# EAGLE design LoRaPi-0 (EAGLE 9.6.2)
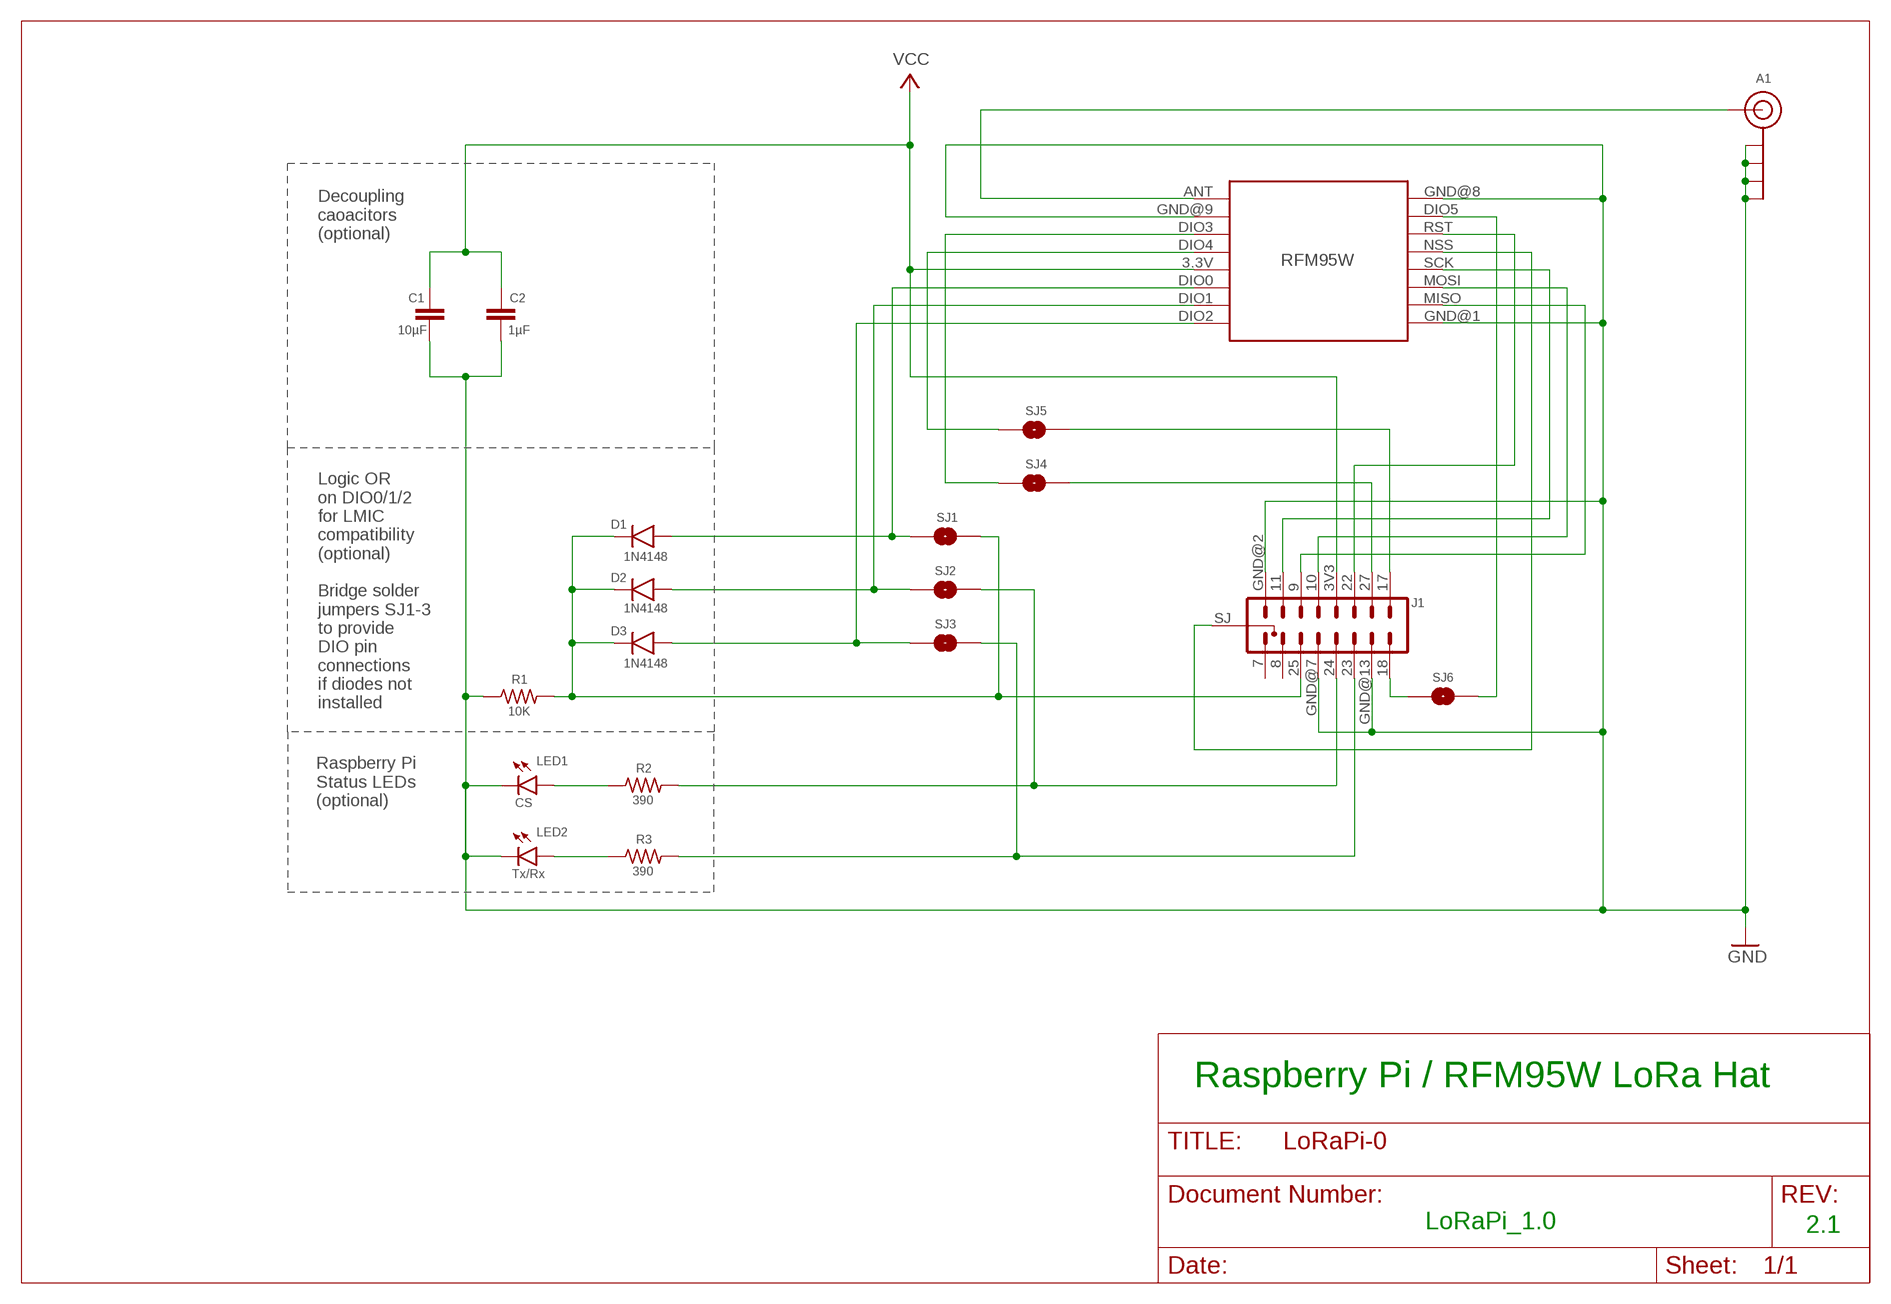
[diagram p0: schematic, sheet 1]

## Parts
A1  U.FL-SMA-EDGE-COMBO  [U.FL-SMA-EDGE-COMBO]
C1  10µF  CAPACITOR  [C0805]
C2  1µF  CAPACITOR  [C0805]
D1  1N4148  1N4148SMD  [SOD-123]
D2  1N4148  1N4148SMD  [SOD-123]
D3  1N4148  1N4148SMD  [SOD-123]
J1  HEADER-2X8-RFM95W-PI  [CONN_2X8-RFM-PI]
LED1  CS  LEDCHIP-LED0805  [CHIP-LED0805]
LED2  Tx/Rx  LEDCHIP-LED0805  [CHIP-LED0805]
R1  10K  R-US_R0805  [R0805]
R2  390  R-US_R0805  [R0805]
R3  390  R-US_R0805  [R0805]
RFM95W  RFM95W-LORA  [RFM95W-LORA]
SJ1  SJ  [SJ]
SJ2  SJ  [SJ]
SJ3  SJ  [SJ]
SJ4  SJ  [SJ]
SJ5  SJ  [SJ]
SJ6  SJ  [SJ]

## Nets
GND: A1.GND@1A(GND) A1.GND@1B(GND) A1.GND@2A(GND) A1.GND@2B(GND) C1.2 C2.2 J1.GND@2 J1.GND@7 J1.GND@13 LED1.C LED2.C R1.1 RFM95W.GND@1(GND.1) RFM95W.GND@8(GND.2) RFM95W.GND@9(GND.3)
N$1: LED2.A R3.1
N$2: LED1.A R2.1
N$3: J1.18 SJ6.1
N$4: J1.SJ(8-9) RFM95W.NSS
N$5: J1.23 R3.2 SJ3.2
N$6: J1.24 R2.2 SJ2.2
N$7: D1.2 RFM95W.DIO0 SJ1.1
N$8: RFM95W.DIO4 SJ5.1
N$9: RFM95W.DIO3 SJ4.1
N$10: D1.1 D2.1 D3.1 J1.25 R1.2 SJ1.2
N$11: A1.SIG RFM95W.ANT
N$12: D2.2 RFM95W.DIO1 SJ2.1
N$13: J1.22 RFM95W.RST
N$14: D3.2 RFM95W.DIO2 SJ3.1
N$15: J1.11 RFM95W.SCK
N$16: J1.10 RFM95W.MOSI
N$17: J1.9 RFM95W.MISO
N$18: J1.27 SJ4.2
N$19: J1.17 SJ5.2
N$20: RFM95W.DIO5 SJ6.2
VCC: C1.1 C2.1 J1.3V3 RFM95W.3.3V
Unconnected: J1.7 J1.8

## Notes on the sheet
- Decoupling
  caoacitors
  (optional)
- Logic OR
  on DIO0/1/2
  for LMIC
  compatibility
  (optional)
  
  Bridge solder
  jumpers SJ1-3
  to provide
  DIO pin
  connections
  if diodes not
  installed
- Raspberry Pi
  Status LEDs
  (optional)
- Raspberry Pi / RFM95W LoRa Hat
- LoRaPi_1.0 | 2.1

## Library data of the parts
A1 = digitalconcepts:U.FL-SMA-EDGE-COMBO: Combination u.FL & SMA edge mount antenna
C1 C2 = digitalconcepts:CAPACITOR: 0805 Capacitor
D1-D3 = digitalconcepts:1N4148: 1N4148 SOD-123 Signal Diode
J1 = digitalconcepts:HEADER-2X8-RFM95W-PI: PI-RFM95W 2x16 Pin Header for Raspberry Pi RFM95W daughter baord
LED1 LED2 = led:LED: LED OSRAM: - CHIPLED LG R971, LG N971, LY N971, LG Q971, LY Q971, LO R971, LY R971 LH N974, LH R974 LS Q976, LO Q976, LY Q976 LO Q996 - Hyper CHIPLED LW Q18S LB Q993, LB Q99A, LB R99A - SideLED LS A670, LO A670, LY A670, LG A670, LP A670 LB A673, LV A673, LT A673, LW A673 LH A674 LY A675 LS A676, LA A676, LO A676, LY A676, LW A676 LS A679, LY A679, LG A679 - Hyper Micro SIDELED® LS Y876, LA Y876, LO Y876, LY Y876 LT Y87S - SmartLED LW L88C, LW L88S LB L89C, LB L89S, LG L890 LS L89K, LO L89K, LY L89K LS L896, LA L896, LO L896, LY L896 - TOPLED LS T670, LO T670, LY T670, LG T670, LP T670 LSG T670, LSP T670, LSY T670, LOP T670, LYG T670 LG T671, LOG T671, LSG T671 LB T673, LV T673, LT T673, LW T673 LH T674 LS T676, LA T676, LO T676, LY T676, LB T676, LH T676, LSB T676, LW T676 LB T67C, LV T67C, LT T67C, LS T67K, LO T67K, LY T67K, LW E67C LS E67B, LA E67B, LO E67B, LY E67B, LB E67C, LV E67C, LT E67C LW T67C LS T679, LY T679, LG T679 LS T770, LO T770, LY T770, LG T770, LP T770 LB T773, LV T773, LT T773, LW T773 LH T774 LS E675, LA E675, LY E675, LS T675 LS T776, LA T776, LO T776, LY T776, LB T776 LHGB T686 LT T68C, LB T68C - Hyper Mini TOPLED® LB M676 - Mini TOPLED Santana® LG M470 LS M47K, LO M47K, LY M47K Source: http://www.osram.convergy.de LUXEON: - LUMILED® LXK2-PW12-R00, LXK2-PW12-S00, LXK2-PW14-U00, LXK2-PW14-V00 LXK2-PM12-R00, LXK2-PM12-S00, LXK2-PM14-U00 LXK2-PE12-Q00, LXK2-PE12-R00, LXK2-PE12-S00, LXK2-PE14-T00, LXK2-PE14-U00 LXK2-PB12-K00, LXK2-PB12-L00, LXK2-PB12-M00, LXK2-PB14-N00, LXK2-PB14-P00, LXK2-PB14-Q00 LXK2-PR12-L00, LXK2-PR12-M00, LXK2-PR14-Q00, LXK2-PR14-R00 LXK2-PD12-Q00, LXK2-PD12-R00, LXK2-PD12-S00 LXK2-PH12-R00, LXK2-PH12-S00 LXK2-PL12-P00, LXK2-PL12-Q00, LXK2-PL12-R00 Source: www.luxeon.com KINGBRIGHT: KA-3528ASYC Source: www.kingbright.com
R1-R3 = digitalconcepts:R-US_: RESISTOR, American symbol; SPICEPREFIX: R
RFM95W = digitalconcepts:RFM95W-LORA: RFM95W LoRa Wireless Transceiver
SJ1-SJ6 = digitalconcepts:SJ: Solder Jumper

## Board
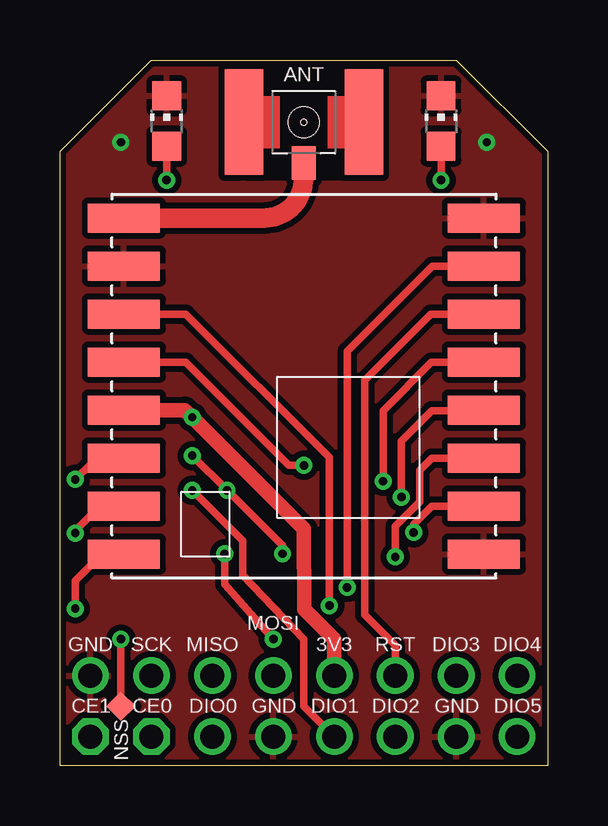
[diagram p1: board, top side]
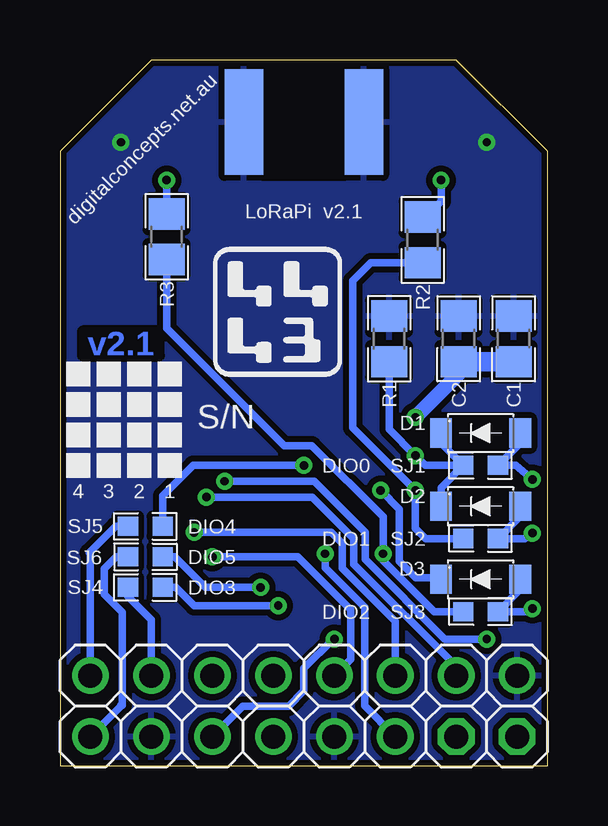
[diagram p2: board, bottom side, seen from below]

Size 20.32 x 29.4 mm. Coordinates in mm from the lower left corner, seen from the top.
Outline: 0,0 0,25.59 3.81,29.4 16.51,29.4 20.32,25.59 20.32,0 0,0
Copper layers (1*16): Top 0.0356mm / dielectric 1.5011mm / Bottom 0.0356mm
Design rules "PCBs_io *": minimum track width 6mil, minimum drill 13mil, track to track 6mil, track to pad 6mil, pad to pad 6mil, via to via 6mil, smd to smd 6mil, copper to edge 6mil, drill to drill 6mil, minimum pad ring 7mil, minimum via ring 7mil, stop-mask expansion 3mil, vias tented up to drill 0mil, thermal gap 10mil

### Footprints (pad centres in the part's own frame; a part is rotated, then mirrored left to right if it is on the bottom)
U.FL-SMA-EDGE-COMBO = smd 1.6 x 4.4: GND@1A -2.5,0; GND@2A 2.5,0 | smd 1.6 x 4.4 bottom: GND@1B -2.5,0; GND@2B 2.5,0 | smd 1 x 1.4: SIG 0,-1.7
C0805 = smd 1.3 x 1.5: 1 -0.95,0; 2 0.95,0
SOD-123 = smd 0.91 x 1.22: 1 1.65,0; 2 -1.65,0
CONN_2X8-RFM-PI = drill 1 pad 1.524: 3V3 7.62,2.54; 9 2.54,2.54; 10 5.08,2.54; 11 0,2.54; 17 15.24,2.54; 18 15.24,0; 22 10.16,2.54; 23 10.16,0; 24 7.62,0; 25 2.54,0; 27 12.7,2.54; GND@2 -2.54,2.54; GND@7 5.08,0; GND@13 12.7,0 | drill 1 pad 1.524 octagon: 7 -2.54,0; 8 0,0 | smd 0.864 x 0.864 rotated 45: SJ -1.27,1.27
CHIP-LED0805 = smd 1.2 x 1.2: A 0,-1.05; C 0,1.05
R0805 = smd 1.3 x 1.5: 1 -0.95,0; 2 0.95,0
RFM95W-LORA = smd 3 x 1.2: 3.3V 7.5,1; ANT 7.5,-7; DIO0 7.5,3; DIO1 7.5,5; DIO2 7.5,7; DIO3 7.5,-3; DIO4 7.5,-1; DIO5 -7.5,-5; GND@1 -7.5,7; GND@8 -7.5,-7; GND@9 7.5,-5; MISO -7.5,5; MOSI -7.5,3; NSS -7.5,-1; RST -7.5,-3; SCK -7.5,1
SJ = smd 0.85 x 0.8: 1 -0.725,0; 2 0.725,0

### Placement (x,y rotation side)
A1  10.16,26.81 0 top
C1  1.42,17.78 90 bottom
C2  3.71,17.78 90 bottom
D1  2.79,13.86 180 bottom
D2  2.79,10.81 180 bottom
D3  2.79,7.76 180 bottom
J1  3.81,1.21 0 top
LED1  4.45,26.86 0 top
LED2  15.88,26.86 0 top
R1  6.6,17.78 270 bottom
R2  5.21,21.91 270 bottom
R3  15.88,22.03 270 bottom
RFM95W  10.16,15.81 180 top
SJ1  2.79,12.51 180 bottom
SJ2  2.79,9.46 180 bottom
SJ3  2.79,6.41 180 bottom
SJ4  16.76,7.43 180 bottom
SJ5  16.76,9.97 180 bottom
SJ6  16.76,8.7 0 bottom

### Tracks (layer width: path | path; a pad name or v marks a point on that pad's centre or on a via)
GND  (via drill 0.35)
  other vias: 2.54,25.97 17.78,25.97
  pour Top (isolate 0.254): 3.56,30.42 16.64,30.42 21.46,25.59 21.46,-0.83 -1.02,-0.83 -1.02,25.84
  pour Bottom (isolate 0.254): 3.81,29.53 16.51,29.53 20.57,25.46 20.57,-0.06 -0.25,-0.06 -0.25,25.46
N$1  (via drill 0.35)
  Top 0.305: LED2.A v15.88,24.4
  Bottom 0.305: v15.88,24.4 R3.1
N$2  (via drill 0.35)
  Top 0.305: LED1.A v4.45,24.4
  Bottom 0.305: v4.45,24.4 4.45,23.51 5.08,22.87 R2.1
N$3
  Bottom 0.305: SJ6.1 17.98,8.7 18.47,8.21 18.47,7.13 17.73,6.39 17.73,2.52 17.78,2.52 17.78,2.47 J1.18
N$4  (via drill 0.35)
  Top 0.305: v13.46,11.85 13.46,14.8 15.48,16.81 RFM95W.NSS | v2.54,5.27 J1.SJ
  Bottom 0.305: v13.46,11.85 9.73,11.85 7.59,9.71 7.59,8.6 4.29,5.27 v2.54,5.27
N$5  (via drill 0.35)
  Top 0.305: v6.86,8.83 6.86,7.56 v8.89,5.27
  Bottom 0.305: SJ3.2 4.73,6.41 6.86,8.54 v6.86,8.83 6.86,10.36 9.82,13.33 10.98,13.33 15.88,18.22 R3.2 | v8.89,5.27 8.94,5.27 10.16,4.05 10.16,3.11 10.8,2.48 12.7,2.48 J1.23
N$6  (via drill 0.35)
  Top 0.305: v5.51,11.47 7.62,9.36 7.62,7.94 10.16,5.27 10.16,2.48 J1.24
  Bottom 0.305: SJ2.2 5.08,9.46 5.51,9.9 v5.51,11.47 8.13,14.08 8.13,20.2 7.37,20.96 R2.2
N$7  (via drill 0.35)
  Top 0.305: v0.63,11.93 1.95,13.19 RFM95W.DIO0
  Bottom 0.305: v0.63,11.93 1.32,12.51 SJ1.1 1.14,13.43 D1.2
N$8  (via drill 0.35)
  Top 0.305: RFM95W.DIO4 5.23,16.81 9.53,12.51 v10.16,12.51
  Bottom 0.305: v10.16,12.51 14.78,12.51 16.04,11.25 SJ5.1
N$9  (via drill 0.35)
  Top 0.305: v11.23,6.67 11.23,12.85 5.23,18.81 RFM95W.DIO3
  Bottom 0.305: SJ4.1 15.49,7.43 14.73,6.67 v11.23,6.67
N$10  (via drill 0.35)
  Top 0.305: v5.51,12.92 v6.96,11.47 9.27,9.16 v9.27,8.83
  Bottom 0.152: D3.1 4.51,7.83
  Bottom 0.305: v9.27,8.83 9.27,8.24 7.62,6.59 7.62,2.49 J1.25 | SJ1.2 4.44,11.58 D2.1 | D1.1 4.44,13.43 SJ1.2 | 4.51,7.83 5.49,7.83 6.17,8.51 6.17,10.68 v6.96,11.47 | R1.2 6.6,14.01 v5.51,12.92 5.1,12.51 SJ1.2
N$11
  Top 0.813: A1.SIG 10.16,24.6 10.15,24.47 arc-90 8.49,22.81 RFM95W.ANT
N$12  (via drill 0.35)
  Top 0.305: RFM95W.DIO1 2.03,11.19 0.63,9.79 v0.63,9.69
  Bottom 0.305: v0.63,9.69 0.96,9.46 SJ2.1 1.14,10.39 D2.2
N$13
  Top 0.305: RFM95W.RST 15.45,18.81 12.7,16.07 12.7,6.29 13.97,5.02 J1.22
N$14  (via drill 0.35)
  Top 0.305: RFM95W.DIO2 2.12,9.19 0.63,7.71 v0.63,6.54
  Bottom 0.305: v0.63,6.54 0.86,6.41 SJ3.1 1.14,7.34 D3.2
N$15  (via drill 0.35)
  Top 0.305: v14.22,11.19 14.22,13.53 15.49,14.8 17.26,14.8 RFM95W.SCK
  Bottom 0.305: v14.22,11.19 9.8,11.19 8.08,9.46 8.08,8.39 3.81,4.14 J1.11
N$16  (via drill 0.35)
  Top 0.305: RFM95W.MOSI 15.49,12.81 14.99,12.3 14.99,10.99 13.97,9.97 v13.97,8.7
  Bottom 0.305: v13.97,8.7 10.41,8.7 8.2,6.49 8.2,4.43 J1.10
N$17  (via drill 0.35)
  Top 0.305: RFM95W.MISO 15.49,10.81 14.73,10.05 v14.73,9.72
  Bottom 0.305: v14.73,9.72 9.02,9.72 8.56,9.25 8.56,8.22 6.35,6.01 J1.9
N$18
  Bottom 0.305: SJ4.2 17.49,7.05 16.51,6.07 J1.27
N$19
  Bottom 0.305: SJ5.2 18,9.97 19.09,8.87 19.05,8.83 J1.17
N$20  (via drill 0.35)
  Top 0.305: v11.96,7.43 11.96,17.26 15.51,20.81 RFM95W.DIO5
  Bottom 0.305: SJ6.2 15.53,8.7 14.26,7.43 v11.96,7.43
VCC  (via drill 0.35)
  Top 0.305: 10.16,9.86 10.16,9.84
  Top 0.61: 10.16,9.84 10.19,6.54 10.19,6.52 11.43,5.27 J1.3V3 | RFM95W.3.3V 5.2,14.81 v5.5,14.51 v5.51,14.52 10.16,9.86
  Bottom 0.61: C2.1 3.71,16.32 v5.51,14.52
  Bottom 0.813: C1.1 C2.1

### Text on the board
Bottom: v2.1
tPlace: ANT
bPlace: digitalconcepts.net.au | LoRaPi v2.1 | S/N | 1 | 2 | 3 | 4
tNames: MOSI | GND | SCK | MISO | 3V3 | RST | DIO3 | DIO4 | CE1 | CE0 | DIO0 | GND | DIO1 | DIO2 | GND | DIO5 | NSS
bNames: DIO0 | DIO4 | DIO1 | DIO5 | DIO3 | DIO2